# Altium schematic sheet interfaces.SchDoc: 004-H-01 SD data logger
size A3; Organization: Sunflare Solar Team; Address1: Drachten; Address2: The Netherlands; Revision: V1.00; SheetNumber: 1; SheetTotal: 1
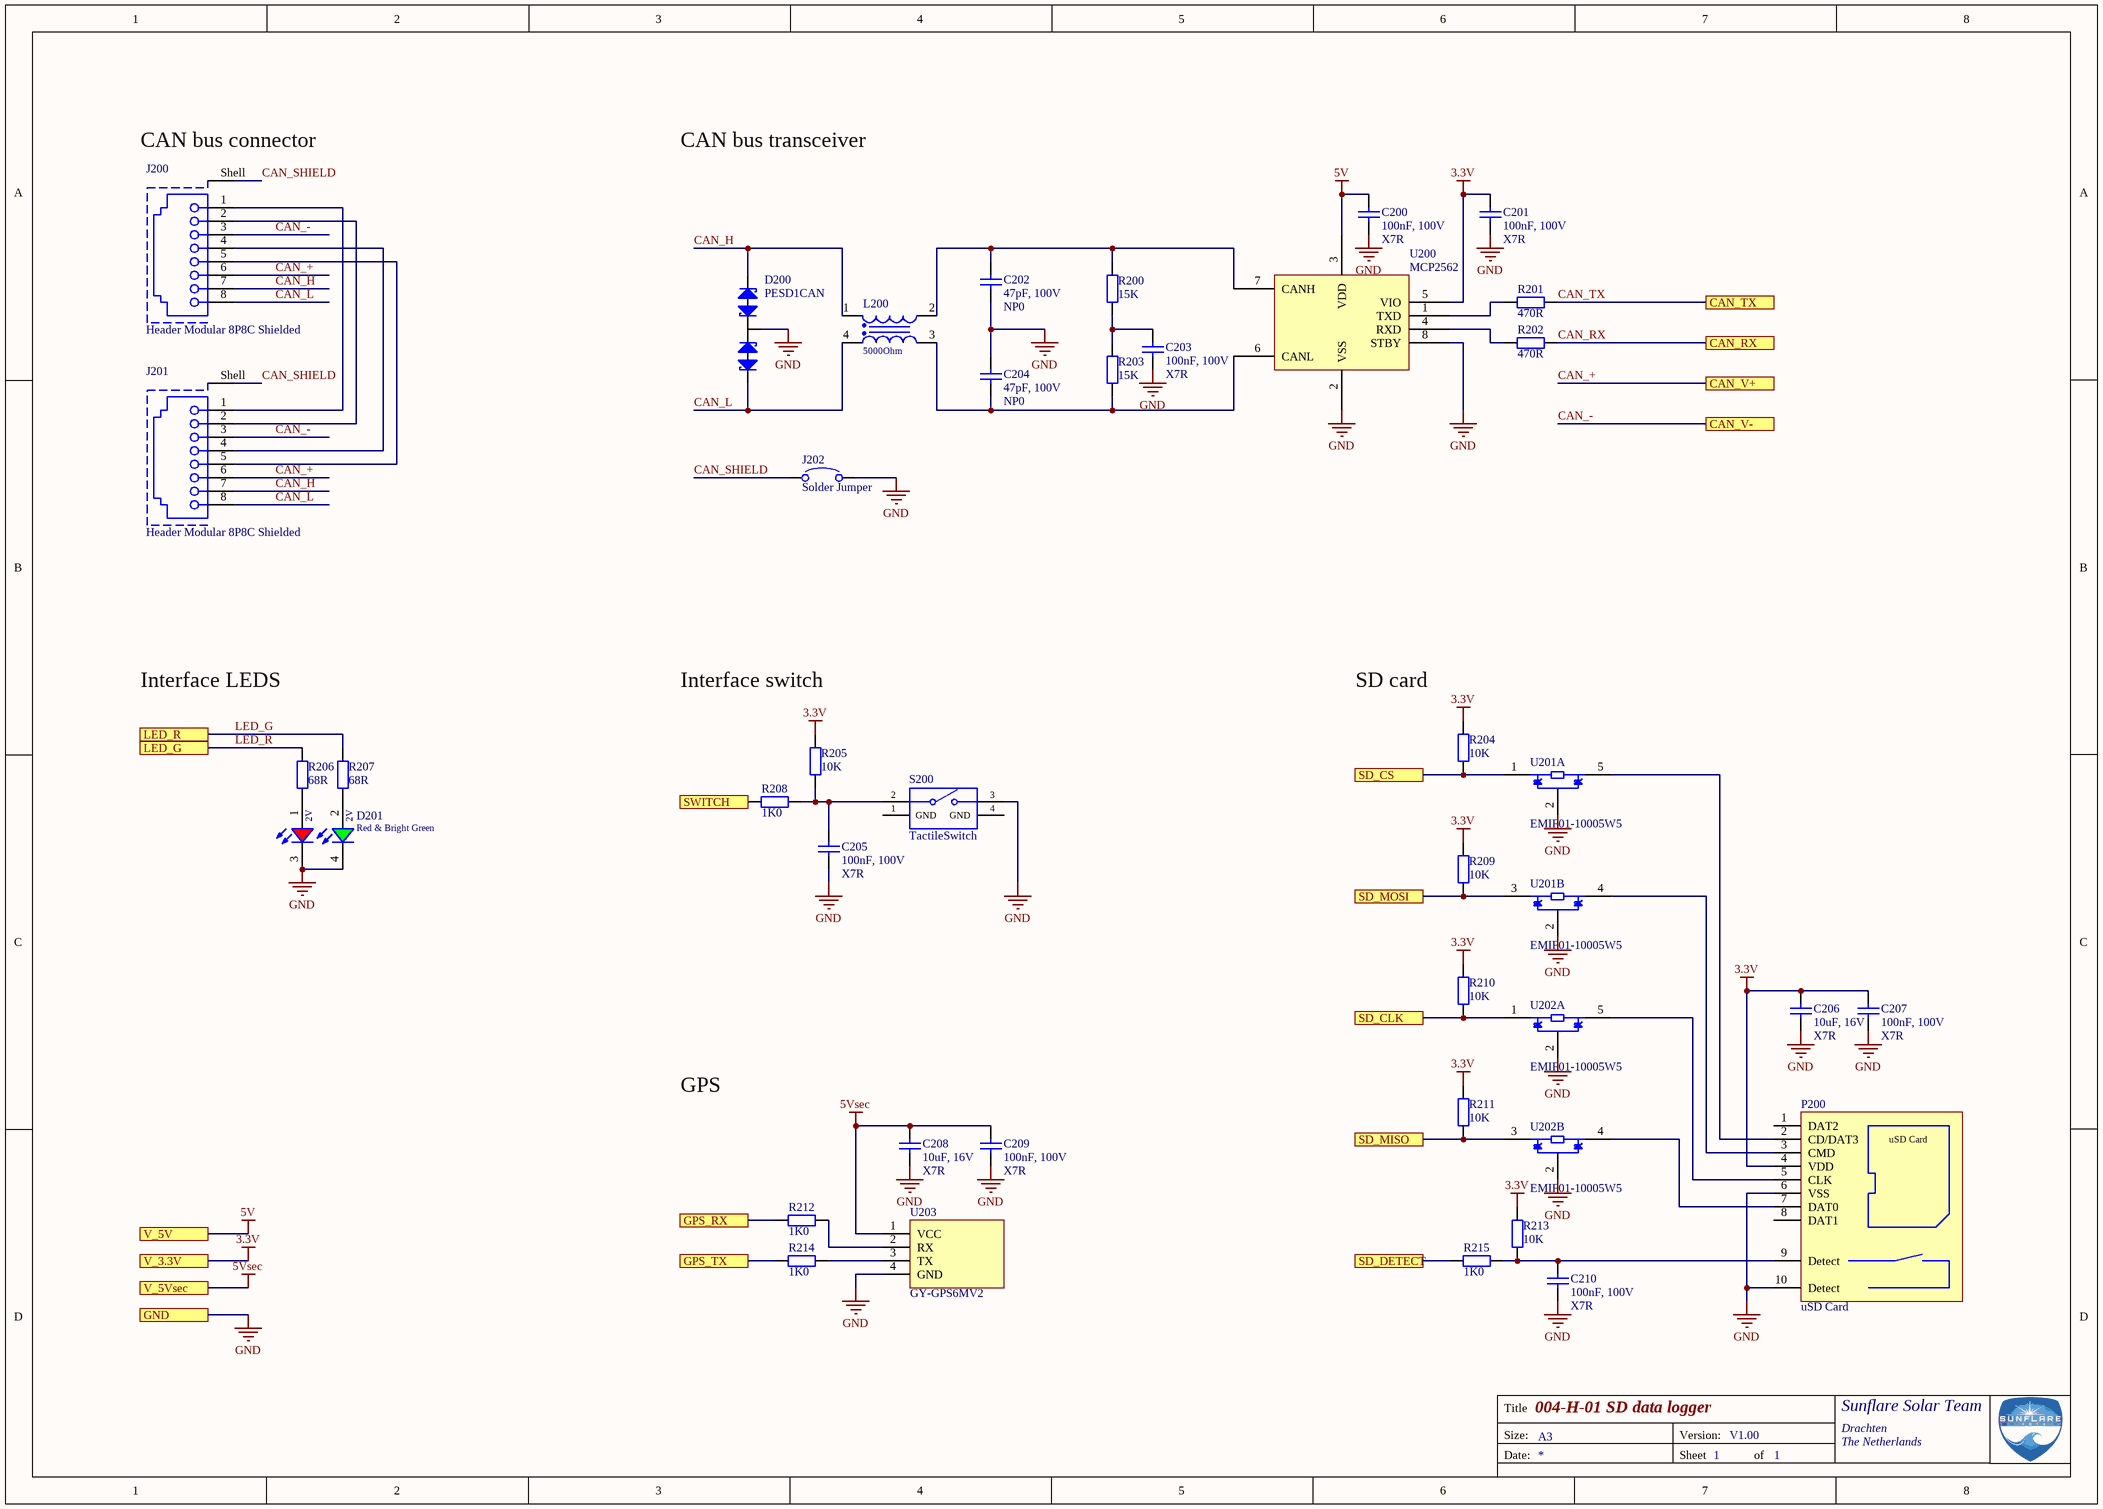
[diagram p0: interfaces.SchDoc]

## Parts
C200  100nF, 100V  Ceramic Type: X7R  [CAP_0805]
C201  100nF, 100V  Ceramic Type: X7R  [CAP_0805]
C202  47pF, 100V  Ceramic Type: NP0  [CAP_0805]
C203  100nF, 100V  Ceramic Type: X7R  [CAP_0805]
C204  47pF, 100V  Ceramic Type: NP0  [CAP_0805]
C205  100nF, 100V  Ceramic Type: X7R  [CAP_0805]
C206  10uF, 16V  Ceramic Type: X7R  [CAP_1210]
C207  100nF, 100V  Ceramic Type: X7R  [CAP_0805]
C208  10uF, 16V  Ceramic Type: X7R  [CAP_1210]
C209  100nF, 100V  Ceramic Type: X7R  [CAP_0805]
C210  100nF, 100V  Ceramic Type: X7R  [CAP_0805]
D200  PESD1CAN  [SOT23-3N]
D201  Red & Bright Green  [WL-SBTW_3528]
J200  Header Modular 8P8C Shielded  [WE-615008140621]
J201  Header Modular 8P8C Shielded  [WE-615008140621]
J202  Solder Jumper  [SolderJumer]  (no BOM)
L200  5000Ohm  [WE-CNSW_1812]
P200  uSD Card  [DM3AT-SF-PEJM5]
R200  15K  [RES_0805]
R201  470R  [RES_0805]
R202  470R  [RES_0805]
R203  15K  [RES_0805]
R204  10K  [RES_0805]
R205  10K  [RES_0805]
R206  68R  [RES_0805]
R207  68R  [RES_0805]
R208  1K0  [RES_0805]
R209  10K  [RES_0805]
R210  10K  [RES_0805]
R211  10K  [RES_0805]
R212  1K0  [RES_0805]
R213  10K  [RES_0805]
R214  1K0  [RES_0805]
R215  1K0  [RES_0805]
S200  TactileSwitch  [4312560387x6]
U200  MCP2562  [SOIC-8N]
U201  EMIF01-10005W5  [SOT95P280X110-6N]  (parts A,B of 2)
U202  EMIF01-10005W5  [SOT95P280X110-6N]  (parts A,B of 2)
U203  GY-GPS6MV2  [GY-GPS6MV2]

## Ports
CAN_RX, CAN_TX, CAN_V+, CAN_V-, GND, GPS_RX, GPS_TX, LED_G, LED_R, SD_CLK, SD_CS, SD_DETECT, SD_MISO, SD_MOSI, SWITCH, V_3.3V, V_5V, V_5Vsec

## Nets
3.3V: C201.2 C206.2 C207.2 P200.4(VDD) R204.2 R205.2 R209.2 R210.2 R211.2 R213.2 U200.5(VIO) ; port V_3.3V
5V: C200.2 U200.3(VDD) ; port V_5V
5Vsec: C208.2 C209.2 U203.1(VCC) ; port V_5Vsec
GND: C200.1 C201.1 C202.1 C203.1 C204.2 C205.1 C206.1 C207.1 C208.1 C209.1 C210.1 D200.3 D201.3(K) D201.4(K) J202.2 P200.6(VSS) P200.10(Detect) S200.3 U200.2(VSS) U200.8(STBY) U201.2 U202.2 U203.4(GND) ; port GND
CAN_+: J200.6 J201.6 ; port CAN_V+
CAN_-: J200.3 J201.3 ; port CAN_V-
CAN_H: D200.2 J200.7 J201.7 L200.1
CAN_L: D200.1 J200.8 J201.8 L200.4
CAN_RX: R202.2 ; port CAN_RX
CAN_SHIELD: J200.Shell J201.Shell J202.1
CAN_TX: R201.2 ; port CAN_TX
GPS_RX: R212.1 ; port GPS_RX
GPS_TX: R214.1 ; port GPS_TX
LED_G: R207.2 ; port LED_R
LED_R: R206.1 ; port LED_G
SD_CLK: R210.1 U202.1 ; port SD_CLK
SD_CS: R204.1 U201.1 ; port SD_CS
SD_DETECT: R215.1 ; port SD_DETECT
SD_MISO: R211.1 U202.3 ; port SD_MISO
SD_MOSI: R209.1 U201.3 ; port SD_MOSI
SWITCH: R208.1 ; port SWITCH
NetC202_2: C202.2 L200.2 R200.2 U200.7(CANH)
NetC203_2: C203.2 R200.1 R203.2
NetC204_1: C204.1 L200.3 R203.1 U200.6(CANL)
NetC205_2: C205.2 R205.1 R208.2 S200.2
NetC210_2: C210.2 P200.9(Detect) R213.1 R215.2
NetD201_1: D201.1(A) R206.2
NetD201_2: D201.2(A) R207.1
NetJ200_1: J200.1 J201.1
NetJ200_2: J200.2 J201.2
NetJ200_4: J200.4 J201.4
NetJ200_5: J200.5 J201.5
NetP200_2: P200.2(CD/DAT3) U201.5
NetP200_3: P200.3(CMD) U201.4
NetP200_5: P200.5(CLK) U202.5
NetP200_7: P200.7(DAT0) U202.4
NetR201_1: R201.1 U200.1(TXD)
NetR202_1: R202.1 U200.4(RXD)
NetR212_2: R212.2 U203.2(RX)
NetR214_2: R214.2 U203.3(TX)

Not connected (* = marked no-connect by the designer): P200 1(DAT2) 8(DAT1); S200 1(GND) 4(GND)

## Notes on the sheet
- (near J200) CAN bus connector
- CAN bus transceiver
- Interface LEDS
- Interface switch
- (near R204) SD card
- GPS
- Title
- Size:
- Date:
- A3
- Version:
- Sheet
- of

## Library data of the parts
C200 C201 C203 C205 C207 C209 C210 = CAP_0805_100nF_100V: WCAP-CSGP Multilayer Ceramic Chip Capacitor, General Purpose, size 0805, X7R, 100nF, 100V; Manufacturer Part Number: 885012207128; Manufacturer: Wurth Elektronik; Rated Voltage: 100VDC; Isolation Resistance: >=1GOhm; Capacitance Tolerance: +/-10%; Technical Reference: X7R0805104K100DFCT10000; ComponentLink1Description: Manufacturer; ComponentLink1URL: http://www.we-online.de; ComponentLink2Description: Datasheet; ComponentLink2URL: https://www.we-online.com/catalog/datasheet/885012207128.pdf; Operating Temperature: -55 to +125degC; Packaging: Tape and Reel; Published Date: May 2020; Dissipation Factor: =<2.5%; Height: 1.25mm; Mounting Technology: SMT; Size: 0805; Capacitance: 100nF; Supplier 1: Farnell; Supplier Part Number 1: 2812440
C202 C204 = CAP_0805_47pF_100V: WCAP-CSGP Multilayer Ceramic Chip Capacitor, General Purpose, size 0805, NP0, 47pF, 100V; Manufacturer Part Number: 885012007080; Manufacturer: Wurth Elektronik; Rated Voltage: 100VDC; Isolation Resistance: >=10GOhm; Capacitance Tolerance: +/-5%; Dissipation Factor: Q>=1000; Technical Reference: NP00805470J100DFCT10000; ComponentLink1Description: Manufacturer; ComponentLink1URL: http://www.we-online.de; ComponentLink2Description: Datasheet; ComponentLink2URL: https://www.we-online.com/catalog/datasheet/885012007080.pdf; Operating Temperature: -55 to +125degC; Packaging: Tape and Reel; Published Date: May 2020; Height: 0.6mm; Mounting Technology: SMT; Size: 0805; Capacitance: 47pF; Supplier 1: Farnell; Supplier Part Number 1: 2812160
C206 C208 = CAP_1210_10uF_16V: WCAP-CSGP Multilayer Ceramic Chip Capacitor, General Purpose, size 1210, X7R, 10uF, 16V; Manufacturer Part Number: 885012209014; Manufacturer: Wurth Elektronik; Rated Voltage: 16VDC; Isolation Resistance: >=0.1GOhm; Capacitance Tolerance: +/-10%; Technical Reference: X7R1210106K016DFCT10000; ComponentLink1Description: Manufacturer; ComponentLink1URL: http://www.we-online.de; ComponentLink2Description: Datasheet; ComponentLink2URL: https://www.we-online.com/catalog/datasheet/885012209014.pdf; Operating Temperature: -55 to +125degC; Packaging: Tape and Reel; Published Date: May 2020; Dissipation Factor: =<5%; Height: 2mm; Mounting Technology: SMT; Size: 1210; Capacitance: 10uF
D200 = PESD1CAN: ESD Protection Device, TVS, 70 V, SOT-23, 3 Pins; Manufacturer: NXP; Manufacturer Part No: PESD1CAN; Supplier 1: Farnell; Supplier Part Number 1: 1510703
D201 = LED bicolor, Red and Green: WL-SBTW SMD Bi-color TOP LED Waterclear, Red & Bright Green, 120degC; Part Number: 150141RV73100; Viewing Angle: 120deg; Peak Wavelength: 630nm@Red, 572nm@Bright Green; Dominant Wavelength: 625nm@Red, 570nm@Bright Green; Luminous Intensity: 250mcd@Red, 60mcd@Bright Green; Chip Technology: AlInGaP; Forward Voltage: 2V; ComponentLink1Description: Manufacturer; ComponentLink1URL: http://www.we-online.de; ComponentLink2Description: Datasheet; ComponentLink2URL: https://katalog.we-online.de/led/datasheet/150141RV73100.pdf; Published Date: June 2019; Publisher: Wurth Elektronik; Size: 3528; Operating Temperature: -40 to +85degC; Emitting Color: Red & Bright Green; Mounting Technology: SMT; Packaging: Tape and Reel; Supplier 1: Farnell; Supplier Part Number 1: 2322113
J200 J201 = Header Modular 8P8C Shielded: WR-MJ Modular Jack THT Horizontal Shielded with EMI Panel Finger 8P8C Tab Up; Manufacturer: Wurth Elektronik; Manufacturer Part Number: 615008140621; Rated Current: 1.5A; Contact Resistance: 20mOhm; Insulation Resistance: 500MOhm; Working Voltage: 120VAC; Withstanding Voltage: 1000VAC; ComponentLink1Description: Manufacturer; ComponentLink1URL: http://www.we-online.de; ComponentLink2Description: Datasheet; ComponentLink2URL: https://katalog.we-online.com/em/datasheet/615008140621.pdf; Packaging: Tray; Mounting Technology: THT; Operating Temperature: -40 to +85degC; Published Date: September 2020; xPxC: 8P8C; Type: Horizontal; Supplier 1: Farnell; Supplier Part Number 1: 1841173
J202 = SolderJumper: Solder jumper open; Manufacturer: -; Manufacturer Part No: -
L200 = CommonModeChoke: WE-CNSW SMT Common Mode Line Filter, size 1812, 5000Ohm, 0.45A, 60V; Manufacturer Part Number: 744235110; Manufacturer: Wurth Elektronik; DC Resistance max.: 0.8Ohm; Impedance Test Condition: 100MHz; Insulation Test Voltage: 125VAC; Winding Style: bifiliar; ComponentLink1Description: Manufacturer; ComponentLink1URL: http://www.we-online.de; ComponentLink2Description: Datasheet; ComponentLink2URL: https://www.we-online.com/catalog/datasheet/744235110.pdf; Operating Temperature: -40 to +125degC; Packaging: Tape and Reel; Published Date: April 2020; Rated Current: 0.45A; Size: 1812; Impedance: 5000Ohm; Rated Voltage: 60V; Mounting Technology: SMT; Supplier 1: Farnell; Supplier Part Number 1: 2249869
P200 = uSD slot: SD slot connector with card detect; Manufacturer: Hirose; Manufacturer Part No: DM3AT-SF-PEJM5; Supplier 1: Farnell; Supplier Part Number 1: 2427719
R200 R203 = RES_0805_15K: Thick Film Resistor, size 0805, 1%; Rated Power: 0.125W; Resistance Tolerance: +/-1%; Resistance: 15K; Height: 0.6mm; Operating Temperature: -55 to +155degC; Mounting Technology: SMT; Packaging: Tape and Reel; Size: 0805; Length: 2mm; Width: 1.25mm
R201 R202 = RES_0805_470R: Thick Film Resistor, size 0805, 1%; Rated Power: 0.125W; Resistance Tolerance: +/-1%; Resistance: 470R; Height: 0.6mm; Operating Temperature: -55 to +155degC; Mounting Technology: SMT; Packaging: Tape and Reel; Size: 0805; Length: 2mm; Width: 1.25mm
R204 R205 R209-R211 R213 = RES_0805_10K: Thick Film Resistor, size 0805, 1%; Rated Power: 0.125W; Resistance Tolerance: +/-1%; Resistance: 10K; Height: 0.6mm; Operating Temperature: -55 to +155degC; Mounting Technology: SMT; Packaging: Tape and Reel; Size: 0805; Length: 2mm; Width: 1.25mm
R206 R207 = RES_0805_68R: Thick Film Resistor, size 0805, 1%; Rated Power: 0.125W; Resistance Tolerance: +/-1%; Resistance: 68R; Height: 0.6mm; Operating Temperature: -55 to +155degC; Mounting Technology: SMT; Packaging: Tape and Reel; Size: 0805; Length: 2mm; Width: 1.25mm
R208 R212 R214 R215 = RES_0805_1K0: Thick Film Resistor, size 0805, 1%; Rated Power: 0.125W; Resistance Tolerance: +/-1%; Resistance: 1K0; Height: 0.6mm; Operating Temperature: -55 to +155degC; Mounting Technology: SMT; Packaging: Tape and Reel; Size: 0805; Length: 2mm; Width: 1.25mm
S200 = TactileSwitch: WS-TATU THT Tact Switch 6x6mm Right Angled Type with ground terminal, height 3.85mm, 160gf; Part Number: 431256038716; Rated Voltage: 12VDC; Rated Current: 50mA; Washable: No; ComponentLink1Description: Manufacturer; ComponentLink1URL: http://www.we-online.de; ComponentLink2Description: Datasheet; ComponentLink2URL: https://katalog.we-online.com/em/datasheet/431256038716.pdf; Operating Temperature: -40 to +85degC; Published Date: September 2019; Contact Material: Stainless Steel; Height: 3.85mm; Mounting Technology: THT; Contact Plating: Silver; Operation Force: 160gf; Packaging: Bulk; Terminal Material: Copper Alloy; Publisher: Wurth Elektronik; Terminal Plating: Silver
U200 = MCP2562: CAN Bus, Transceiver, CAN, LIN, 1, 1, 4.5 V, 5.5 V, SOIC; Manufacturer: Microchip; Manufacturer Part No: MCP2562-E/SN; Supplier 1: Farnell; Supplier Part Number 1: 2362839
U201 U202 = EMIF01-10005W5: 2 Line EMI Filter with ESDProtection; Manufacturer: ST Microelectronics; Manufacturer Part No: EMIF01-10005W5; Supplier 1: Farnell; Supplier Part Number 1: 2629722
U203 = GY-GPS6MV2: GPS module; Manufacturer: NEO; Manufacturer Part No: GY-GPS6MV2